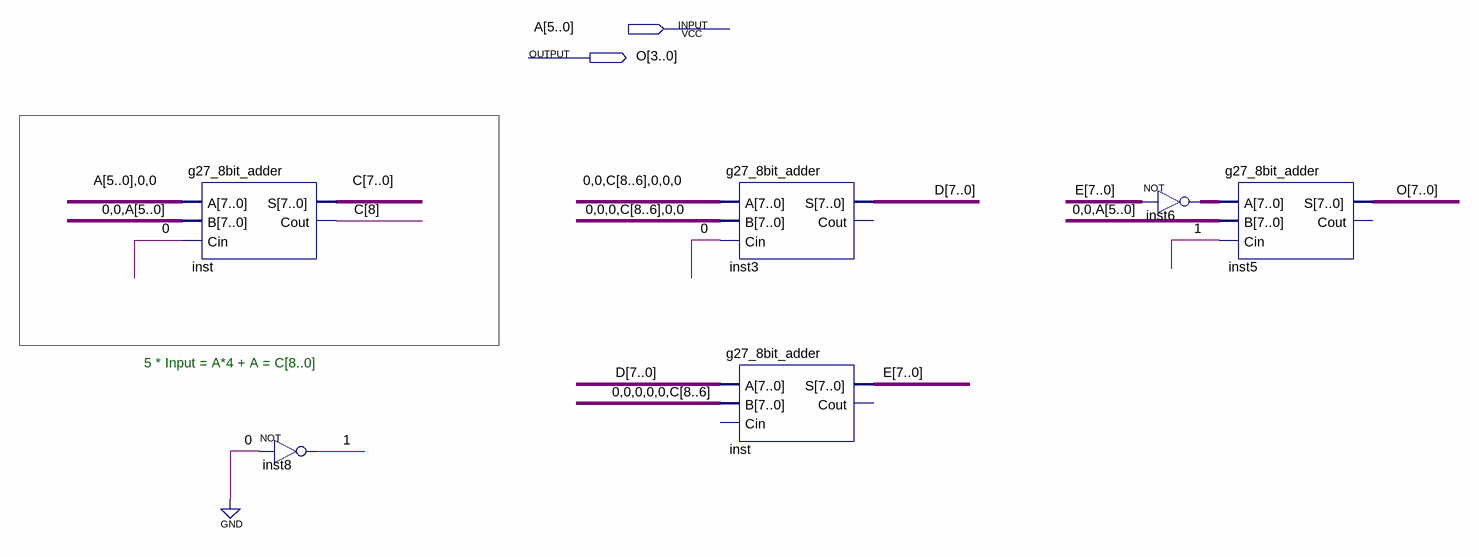
[diagram p0: schematic sheet]
// Quartus schematic g27_modulo_13_draft.bdf as structural Verilog: 6 symbols, 2 pins
module g27_modulo_13_draft (
  input  [5:0] A,
  output [7:0] O
);

  wire \1 ;
  wire [7:0] D, E, inst6_out;
  wire [8:0] C;

  g27_8bit_adder inst (.A({A, 2'b00}), .B({2'b00, A}), .Cin(1'b0), .S(C[7:0]), .Cout(C[8]));
  not inst8 (\1 , 1'b0);
  g27_8bit_adder inst3 (.A({2'b00, C[8:6], 3'b000}), .B({3'b000, C[8:6], 2'b00}), .Cin(1'b0), .S(D));  // open: Cout
  g27_8bit_adder inst_dup2 (.A(D), .B({{5{1'b0}}, C[8:6]}), .S(E));  // open: Cin, Cout
  assign inst6_out = ~E;  // NOT inst6, 8 bits wide
  g27_8bit_adder inst5 (.A(inst6_out), .B({2'b00, A}), .Cin(\1 ), .S(O));  // open: Cout

  // Notes on the sheet:
  //   5 * Input = A*4 + A = C[8..0]
endmodule
